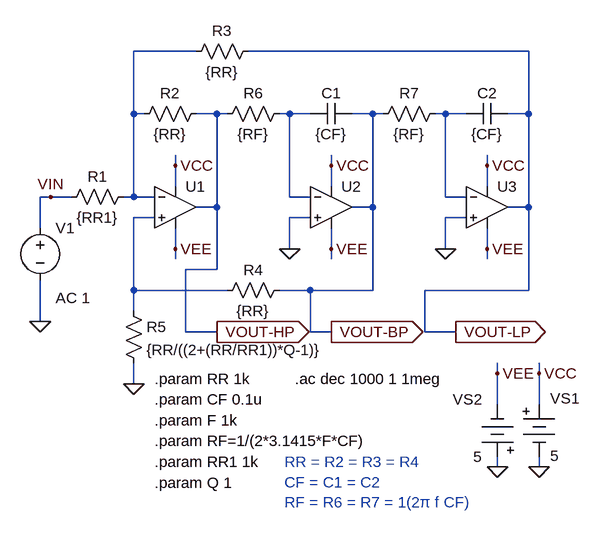
[diagram p0: schematic fig-02-07-07.asc]
fig-02-07-07.asc, the LTspice schematic file:
Version 4
SHEET 1 880 760
WIRE 32 -80 -64 -80
WIRE 544 -80 112 -80
WIRE -64 16 -64 -80
WIRE -48 16 -64 16
WIRE 64 16 32 16
WIRE 80 16 64 16
WIRE 176 16 160 16
WIRE 208 16 176 16
WIRE 304 16 272 16
WIRE 320 16 304 16
WIRE 416 16 400 16
WIRE 448 16 416 16
WIRE 544 16 544 -80
WIRE 544 16 512 16
WIRE 0 96 0 80
WIRE 240 96 240 80
WIRE 480 96 480 80
WIRE 0 128 0 96
WIRE 240 128 240 96
WIRE 480 128 480 96
WIRE -192 144 -208 144
WIRE -160 144 -192 144
WIRE -64 144 -64 16
WIRE -64 144 -80 144
WIRE -32 144 -64 144
WIRE 176 144 176 16
WIRE 208 144 176 144
WIRE 416 144 416 16
WIRE 448 144 416 144
WIRE 64 160 64 16
WIRE 64 160 32 160
WIRE 304 160 304 16
WIRE 304 160 272 160
WIRE 544 160 544 16
WIRE 544 160 512 160
WIRE -32 176 -64 176
WIRE 208 176 176 176
WIRE 448 176 416 176
WIRE -208 192 -208 144
WIRE 0 224 0 192
WIRE 176 224 176 176
WIRE 240 224 240 192
WIRE 416 224 416 176
WIRE 480 224 480 192
WIRE 0 240 0 224
WIRE 240 240 240 224
WIRE 480 240 480 224
WIRE 64 256 64 160
WIRE 64 256 16 256
WIRE -64 288 -64 176
WIRE 80 288 -64 288
WIRE 208 288 160 288
WIRE 304 288 304 160
WIRE 304 288 208 288
WIRE 544 288 544 160
WIRE 544 288 384 288
WIRE -64 320 -64 288
WIRE -208 336 -208 272
WIRE 16 352 16 256
WIRE 64 352 16 352
WIRE 208 352 208 288
WIRE 240 352 208 352
WIRE 384 352 384 288
WIRE 432 352 384 352
WIRE 496 416 496 400
WIRE 560 416 560 400
WIRE -64 432 -64 400
WIRE 496 464 496 416
WIRE 560 464 560 416
WIRE 496 560 496 544
WIRE 560 560 560 544
FLAG -208 336 0
FLAG 432 352 VOUT-LP
IOPIN 432 352 Out
FLAG -64 432 0
FLAG 496 560 0
FLAG 560 560 0
FLAG 496 416 VEE
FLAG 560 416 VCC
FLAG 0 96 VCC
FLAG 0 224 VEE
FLAG -192 144 VIN
FLAG 240 96 VCC
FLAG 240 224 VEE
FLAG 480 96 VCC
FLAG 480 224 VEE
FLAG 176 224 0
FLAG 416 224 0
FLAG 240 352 VOUT-BP
IOPIN 240 352 Out
FLAG 64 352 VOUT-HP
IOPIN 64 352 Out
SYMBOL cap 272 0 R90
WINDOW 0 0 32 VBottom 2
WINDOW 3 32 32 VTop 2
SYMATTR InstName C1
SYMATTR Value {CF}
SYMBOL res 48 0 R90
WINDOW 0 0 56 VBottom 2
WINDOW 3 32 56 VTop 2
SYMATTR InstName R2
SYMATTR Value {RR}
SYMBOL res -64 128 R90
WINDOW 0 0 56 VBottom 2
WINDOW 3 32 56 VTop 2
SYMATTR InstName R1
SYMATTR Value {RR1}
SYMBOL voltage -208 176 R0
WINDOW 123 24 124 Left 2
WINDOW 39 0 0 Left 2
SYMATTR Value2 AC 1
SYMATTR InstName V1
SYMATTR Value ""
SYMBOL res 16 -64 R270
WINDOW 0 32 56 VTop 2
WINDOW 3 0 56 VBottom 2
SYMATTR InstName R3
SYMATTR Value {RR}
SYMBOL Misc\\battery 560 448 R0
WINDOW 0 17 6 Left 2
WINDOW 3 17 95 Left 2
WINDOW 123 0 0 Left 0
WINDOW 39 0 0 Left 0
SYMATTR InstName VS1
SYMATTR Value 5
SYMBOL Misc\\battery 496 560 R180
WINDOW 0 24 104 Left 2
WINDOW 3 24 16 Left 2
WINDOW 123 0 0 Left 0
WINDOW 39 0 0 Left 0
SYMATTR InstName VS2
SYMATTR Value 5
SYMBOL Opamps\\UniversalOpamp2 0 160 R0
SYMATTR InstName U1
SYMATTR Value2 Avol=10Meg GBW=100Meg Slew=10Meg
SYMBOL res 176 0 R90
WINDOW 0 0 56 VBottom 2
WINDOW 3 32 56 VTop 2
SYMATTR InstName R6
SYMATTR Value {RF}
SYMBOL Opamps\\UniversalOpamp2 240 160 R0
SYMATTR InstName U2
SYMATTR Value2 Avol=10Meg GBW=100Meg Slew=10Meg
SYMBOL res 416 0 R90
WINDOW 0 0 56 VBottom 2
WINDOW 3 32 56 VTop 2
SYMATTR InstName R7
SYMATTR Value {RF}
SYMBOL Opamps\\UniversalOpamp2 480 160 R0
SYMATTR InstName U3
SYMATTR Value2 Avol=10Meg GBW=100Meg Slew=10Meg
SYMBOL cap 512 0 R90
WINDOW 0 0 32 VBottom 2
WINDOW 3 32 32 VTop 2
SYMATTR InstName C2
SYMATTR Value {CF}
SYMBOL res 64 304 R270
WINDOW 0 32 56 VTop 2
WINDOW 3 0 56 VBottom 2
SYMATTR InstName R4
SYMATTR Value {RR}
SYMBOL res -80 304 R0
SYMATTR InstName R5
SYMATTR Value {RR/((2+(RR/RR1))*Q-1)}
TEXT 184 424 Left 2 !.ac dec 1000 1 1meg
TEXT 168 552 Left 2 ;RR = R2 = R3 = R4\nCF = C1 = C2\nRF = R6 = R7 = 1(2π f CF)
TEXT -32 424 Left 2 !.param RR 1k
TEXT -32 520 Left 2 !.param RF=1/(2*3.1415*F*CF)
TEXT -32 456 Left 2 !.param CF 0.1u
TEXT -32 584 Left 2 !.param Q 1
TEXT -32 552 Left 2 !.param RR1 1k
TEXT -32 488 Left 2 !.param F 1k

The netlist it stands for:
* fig-02-07-07.asc
C1 VOUT-BP N002 {CF}
R2 VOUT-HP N001 {RR}
R1 N001 VIN {RR1}
V1 VIN 0 AC 1
R3 N001 VOUT-LP {RR}
VS1 VCC 0 5
VS2 0 VEE 5
XU1 N004 N001 VCC VEE VOUT-HP level.2 Avol=10Meg GBW=100Meg Slew=10Meg ilimit=25m rail=0 Vos=0 phimargin=45 en=0 enk=0 in=0 ink=0 Rin=500Meg  ; pins IN+ IN- V+ V- OUT
R6 N002 VOUT-HP {RF}
XU2 0 N002 VCC VEE VOUT-BP level.2 Avol=10Meg GBW=100Meg Slew=10Meg ilimit=25m rail=0 Vos=0 phimargin=45 en=0 enk=0 in=0 ink=0 Rin=500Meg  ; pins IN+ IN- V+ V- OUT
R7 N003 VOUT-BP {RF}
XU3 0 N003 VCC VEE VOUT-LP level.2 Avol=10Meg GBW=100Meg Slew=10Meg ilimit=25m rail=0 Vos=0 phimargin=45 en=0 enk=0 in=0 ink=0 Rin=500Meg  ; pins IN+ IN- V+ V- OUT
C2 VOUT-LP N003 {CF}
R4 N004 VOUT-BP {RR}
R5 N004 0 {RR/((2+(RR/RR1))*Q-1)}
.ac dec 1000 1 1meg
* RR = R2 = R3 = R4
* CF = C1 = C2
* RF = R6 = R7 = 1(2π f CF)
.param RR 1k
.param RF=1/(2*3.1415*F*CF)
.param CF 0.1u
.param Q 1
.param RR1 1k
.param F 1k
.lib UniversalOpamps2.sub
.backanno
.end